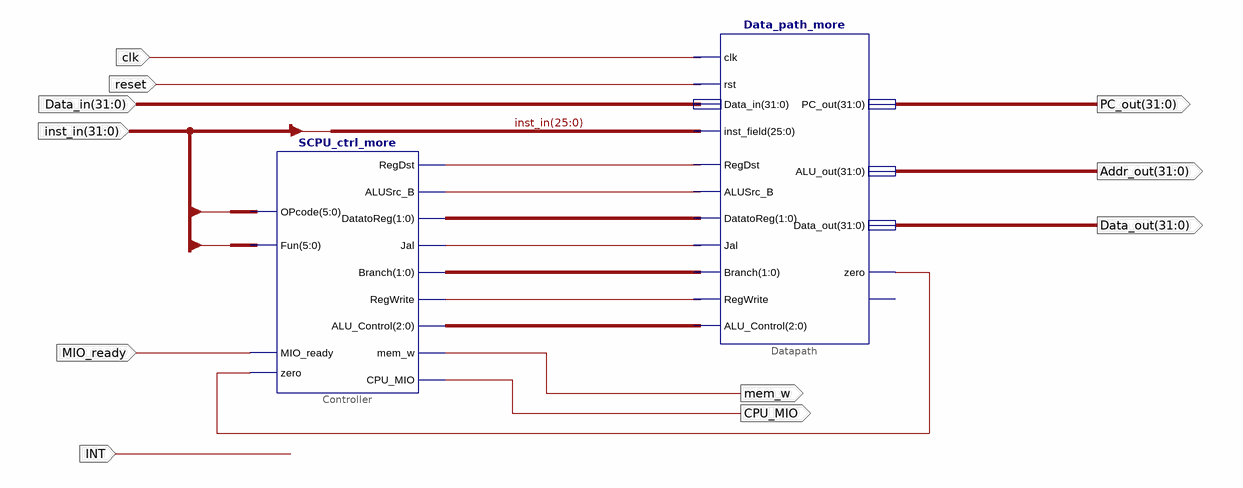
[diagram p0: schematic sheet 1]
// Xilinx ISE schematic SCPU.sch (kintex7) as structural Verilog: 2 symbols, 11 ports
module SCPU (
  input  clk,
  input  reset,
  input  [31:0] Data_in,
  input  [31:0] inst_in,
  input  INT,
  input  MIO_ready,
  output [31:0] PC_out,
  output [31:0] Addr_out,
  output [31:0] Data_out,
  output mem_w,
  output CPU_MIO
);

  wire XLXN_13, XLXN_15, XLXN_17, XLXN_18, XLXN_21;
  wire [1:0] XLXN_14, XLXN_16;
  wire [2:0] XLXN_12;

  SCPU_ctrl_more Controller (
    .RegDst(XLXN_18), .ALUSrc_B(XLXN_17), .DatatoReg(XLXN_16), .Jal(XLXN_15), .ALU_Control(XLXN_12),
    .CPU_MIO(CPU_MIO), .mem_w(mem_w), .Fun(inst_in[5:0]), .OPcode(inst_in[31:26]), .Branch(XLXN_14),
    .RegWrite(XLXN_13), .MIO_ready(MIO_ready), .zero(XLXN_21));
  Data_path_more Datapath (
    .RegDst(XLXN_18), .ALUSrc_B(XLXN_17), .DatatoReg(XLXN_16), .Jal(XLXN_15), .Branch(XLXN_14),
    .RegWrite(XLXN_13), .ALU_Control(XLXN_12), .Data_in(Data_in), .inst_field(inst_in[25:0]), .clk(clk),
    .rst(reset), .PC_out(PC_out), .ALU_out(Addr_out), .Data_out(Data_out), .zero(XLXN_21));  // open: overflow
endmodule
